# Altium project PCB_Project1.PrjPCB
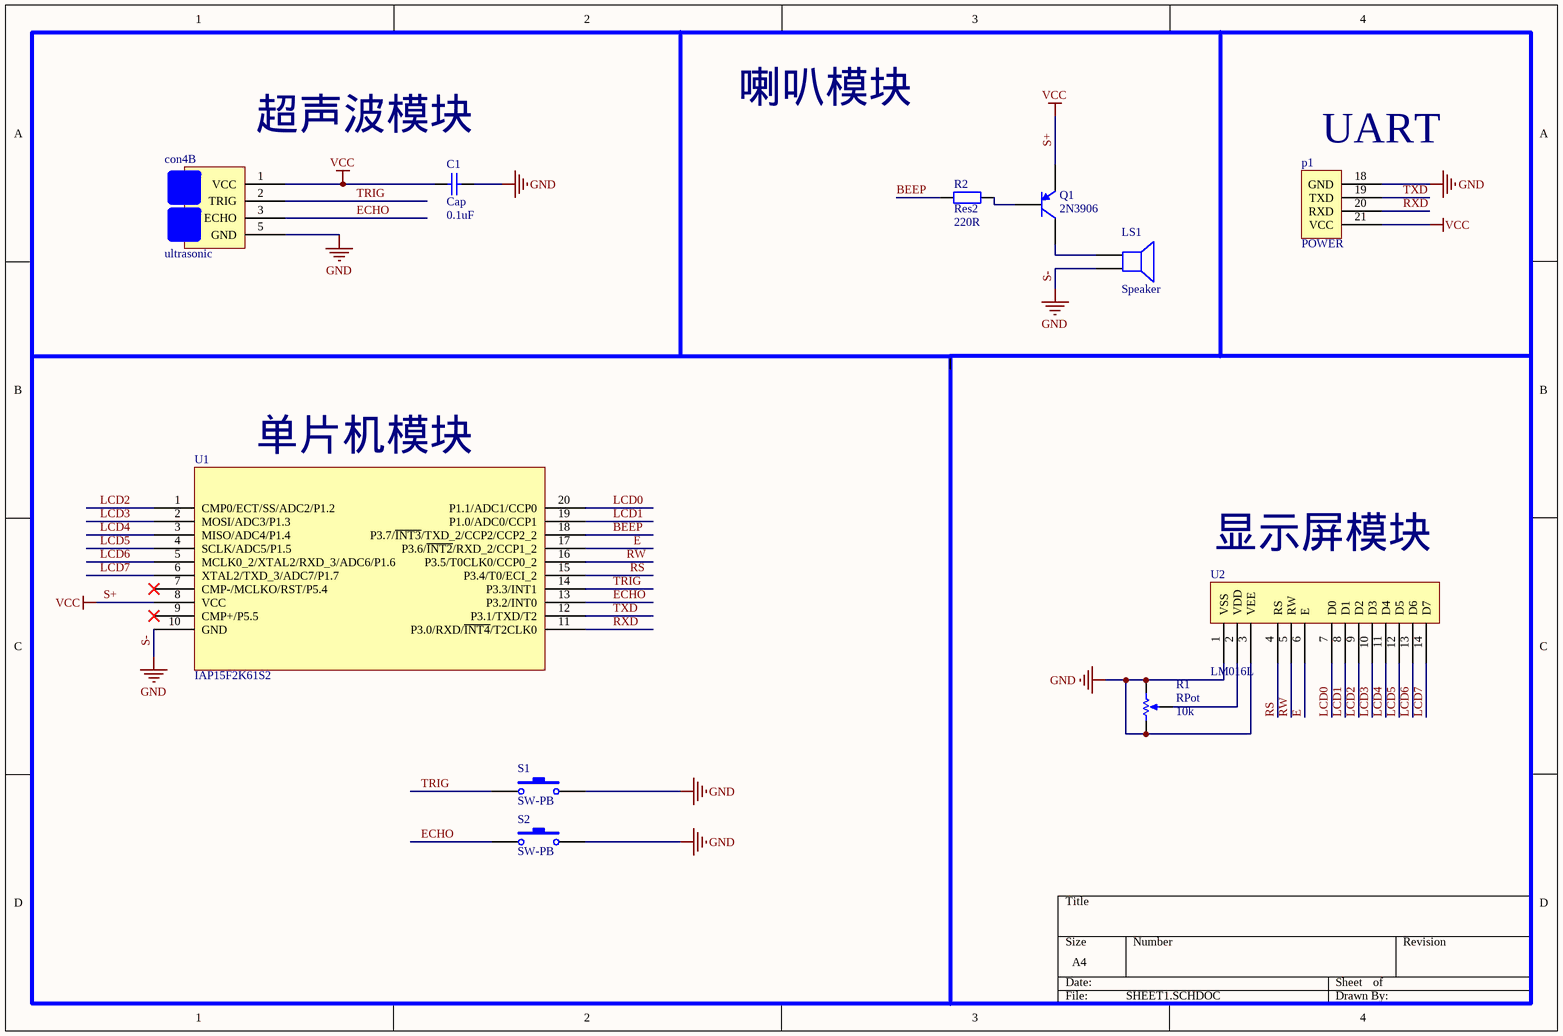
[diagram p0: SHEET1.SCHDOC]
1 sheet, 11 parts. Net scope: global (net labels, ports and power ports of the same name join across sheets).
Board file: PCB1.PcbDoc

## Sheet SHEET1.SCHDOC
size A4

### Parts
C1  Cap  value 0.1uF  [LED]
con4  ultrasonic  [sonic]  (part B of 2)
LS1  Speaker  [SPEAKER]
p1  POWER  [POWER]
Q1  2N3906  [TO-92A]
R1  RPot  value 10k  [RESADJ]
R2  Res2  value 220R  [AXIAL-0.4]
S1  SW-PB  [bottom]
S2  SW-PB  [bottom]
U1  IAP15F2K61S2  [DIP20]
U2  LM016L  [LCD1602]

### Blocks framed on the sheet
单片机模块: S1 S2 U1

### Nets
S+: C1.1 con4.1(VCC) p1.21(VCC) Q1.1(E) U1.8(VCC)  [also labelled VCC]
S-: C1.2 con4.5(GND) LS1.2 p1.18(GND) R1.1(TOP) R1.2(BOT) S1.2 S2.2 U1.10(GND) U2.1(VSS) U2.3(VEE)  [also labelled GND]
BEEP: R2.1 U1.18(P3.7/~{INT3}/TXD_2/CCP2/CCP2_2)
E: U1.17(P3.6/~{INT2}/RXD_2/CCP1_2) U2.6(E)
ECHO: con4.3(ECHO) S2.1 U1.13(P3.2/INT0)
LCD0: U1.20(P1.1/ADC1/CCP0) U2.7(D0)
LCD1: U1.19(P1.0/ADC0/CCP1) U2.8(D1)
LCD2: U1.1(CMP0/ECT/SS/ADC2/P1.2) U2.9(D2)
LCD3: U1.2(MOSI/ADC3/P1.3) U2.10(D3)
LCD4: U1.3(MISO/ADC4/P1.4) U2.11(D4)
LCD5: U1.4(SCLK/ADC5/P1.5) U2.12(D5)
LCD6: U1.5(MCLK0_2/XTAL2/RXD_3/ADC6/P1.6) U2.13(D6)
LCD7: U1.6(XTAL2/TXD_3/ADC7/P1.7) U2.14(D7)
RS: U1.15(P3.4/T0/ECI_2) U2.4(RS)
RW: U1.16(P3.5/T0CLK0/CCP0_2) U2.5(RW)
RXD: p1.20(RXD) U1.11(P3.0/RXD/~{INT4}/T2CLK0)
TRIG: con4.2(TRIG) S1.1 U1.14(P3.3/INT1)
TXD: p1.19(TXD) U1.12(P3.1/TXD/T2)
NetLS1_1: LS1.1 Q1.3(C)
NetQ1_2: Q1.2(B) R2.2
NetR1_3: R1.3(TAP) U2.2(VDD)

Not connected (* = marked no-connect by the designer): U1 7(CMP-/MCLKO/RST/P5.4)* 9(CMP+/P5.5)*

### Notes on the sheet
- 喇叭模块
- (near con4) 超声波模块
- (near p1) UART
- 显示屏模块

### Library data of the parts
C1 = Cap: Capacitor; Published: 8-Jun-2000; LatestRevisionDate: 17-Jul-2002; LatestRevisionNote: Re-released for DXP Platform.; PackageReference: RAD-0.3; Publisher: Altium Limited; PackageDescription: Radial Cap, Thru-Hole; 2 Leads; 0.3 in Pin Spacing
LS1 = Speaker: Loudspeaker; Published: 24-Mar-1999; LatestRevisionDate: 17-Jul-2002; LatestRevisionNote: Re-released for DXP Platform.; PackageReference: PIN2; Publisher: Altium Limited
Q1 = 2N3906: PNP General Purpose Amplifier; Published: 8-Jun-2000; LatestRevisionDate: 15-Jan-2003; LatestRevisionNote: PCB Footprint 'BCY-W3/D4.7' replaced; DatasheetVersion: 1997; PackageVersion: Sep-1998; PackageReference: TO-92A; Publisher: Altium Limited; PackageDescription: TO, Flat Index; 3 In-Line, Axial Leads; Body Dia. 4.5mm; Leads 0.51 x 0.48 mm (max); ComponentLink1Description: Manufacturer Link; ComponentLink1URL: http://www.fairchildsemi.com/; ComponentLink2Description: Datasheet; ComponentLink2URL: http://www.fairchildsemi.com/ds/2N%2F2N3906.pdf
R1 = RPot: Potentiometer; Sim Note: Enter the Resistance value and the set point into parameter fields.; Set Position: 0.5; Published: 8-Jun-2000; LatestRevisionDate: 17-Jul-2002; LatestRevisionNote: Re-released for DXP Platform.; PackageReference: VR5; Publisher: Altium Limited; PackageDescription: Variable Resistor, Thru-Hole; 3 Leads
R2 = Res2: Resistor; Published: 8-Jun-2000; LatestRevisionDate: 17-Jul-2002; LatestRevisionNote: Re-released for DXP Platform.; PackageReference: AXIAL-0.4; Publisher: Altium Limited; PackageDescription: Axial Device, Thru-Hole; 2 Leads; 0.4 in Pin Spacing
S1 S2 = SW-PB: Switch; Published: 24-Mar-1999; LatestRevisionDate: 17-Jul-2002; LatestRevisionNote: Re-released for DXP Platform.; PackageReference: SPST-2; Publisher: Altium Limited; PackageDescription: Switch; 2 Leads